# EAGLE design akabeacon_square_type2_da14580 (EAGLE 7.2.0)
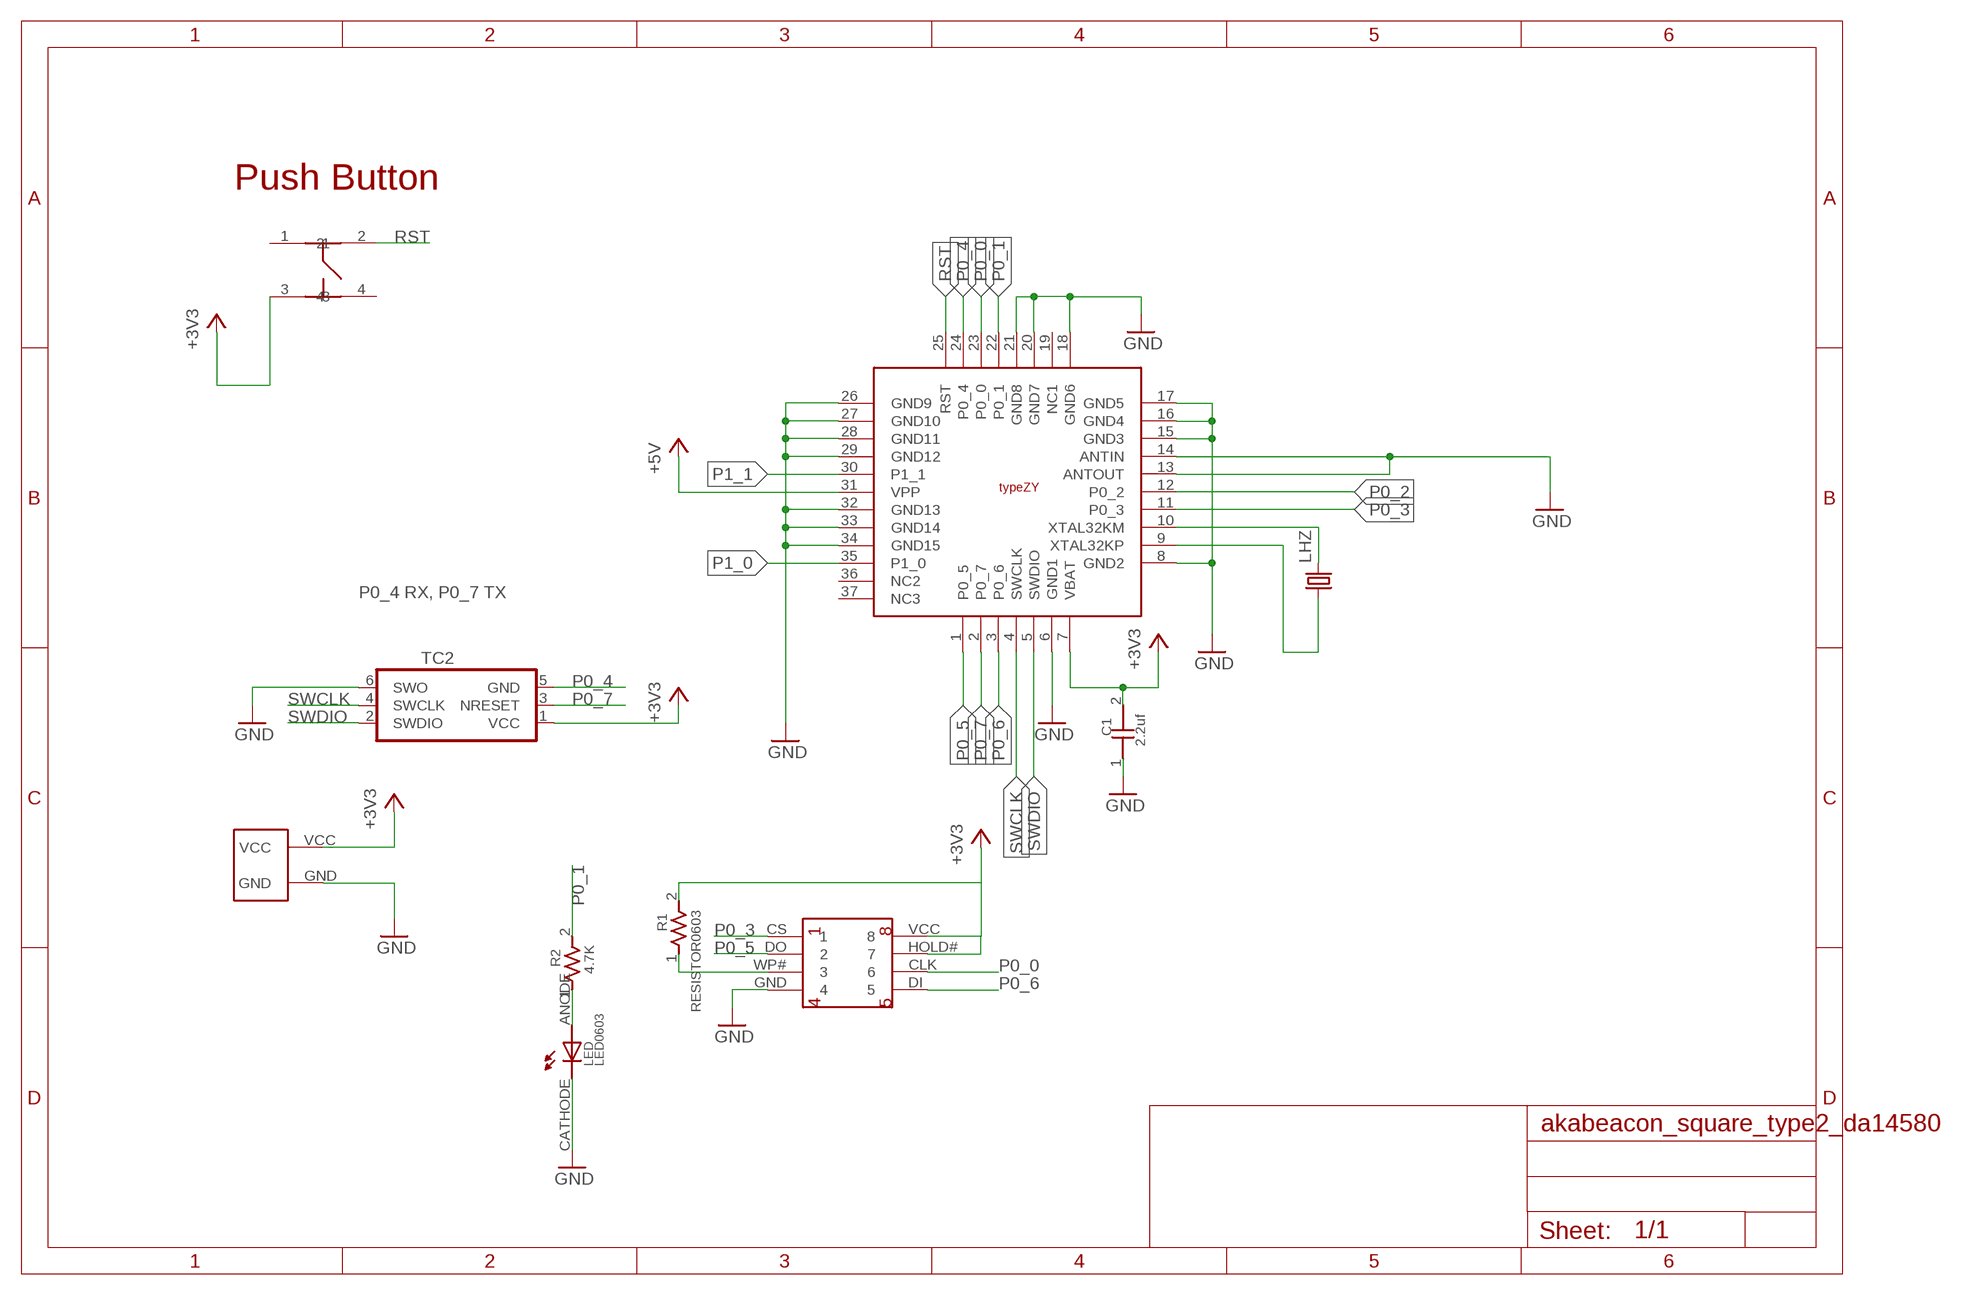
[diagram p0: schematic, sheet 1]

## Parts
C1  2.2uf  CAPACITOR0603  [0603]
LED  LED0603  [0603]
LHZ  FC-12M  [FC-12M]
R1  RESISTOR0603  [0603]
R2  4.7K  RESISTOR0603  [0603]
TC2  TC2030-IDC-NL  [TC2030-IDC-NL]
U$3  FLASH-MEMORY-2M(WINBOND)  [FLASH-MEMORY-2M(WINBOND)]
U$5  SQUARE-TYPE2-TC2030  [SQUARE-TYPE2-TC2030]
U$7  SWICTH-4P(KMR2)  [SWITCH-4P(KMR2)]
U$9  MURATA-TYPEZY  [MURATA_TYPEZY]

## Nets
+3V3: C1.2 R1.2 TC2.1(VCC) U$3.HOLD# U$3.VCC U$5.VCC U$7.3 U$9.7(VBAT)
+5V: U$9.31(VPP)
GND: C1.1 LED.CATHODE TC2.6(SWO) U$3.GND U$5.GND U$9.6(GND1) U$9.8(GND2) U$9.13(ANTOUT) U$9.14(ANTIN) U$9.15(GND3) U$9.16(GND4) U$9.17(GND5) U$9.18(GND6) U$9.20(GND7) U$9.21(GND8) U$9.26(GND9) U$9.27(GND10) U$9.28(GND11) U$9.29(GND12) U$9.32(GND13) U$9.33(GND14) U$9.34(GND15)
N$1: R1.1 U$3.WP#
N$2: LED.ANODE R2.1
P0_0: U$3.CLK U$9.23(P0_0)
P0_1: R2.2 U$9.22(P0_1)
P0_2: U$9.12(P0_2)
P0_3: U$3.CS U$9.11(P0_3)
P0_4: TC2.5(GND) U$9.24(P0_4)
P0_5: U$3.DO U$9.1(P0_5)
P0_6: U$3.DI U$9.3(P0_6)
P0_7: TC2.3(NRESET) U$9.2(P0_7)
P1_0: U$9.35(P1_0)
P1_1: U$9.30(P1_1)
RST: U$7.2 U$9.25(RST)
SWCLK: TC2.4(SWCLK) U$9.4(SWCLK)
SWDIO: TC2.2(SWDIO) U$9.5(SWDIO)
XTAL32KM: LHZ.2 U$9.10(XTAL32KM)
XTAL32KP: LHZ.1 U$9.9(XTAL32KP)
Unconnected: U$7.1 U$7.4 U$9.19(NC1) U$9.36(NC2) U$9.37(NC3)

## Notes on the sheet
- Push Button
- P0_4 RX, P0_7 TX

## Library data of the parts
C1 = GClue-Capacitor:CAPACITOR
LED = GClue-LED:LED
LHZ = crystal:FC-12M: kHz RANGE CRYSTAL UNIT LOW PROFILE SMD Source: Epson Toyocom FC-12M.pdf
R1 R2 = GClue-Resistors:RESISTOR
TC2 = TagConnect:TC2030-IDC: Tag-Connect In Circuit Programming & Debug Cable 6 Pin http://www.tag-connect.com
U$3 = gclue:FLASH-MEMORY-2M(WINBOND)
U$5 = GClue-Beacon:SQUARE-TYPE2-TC2030
U$7 = gclue-test:SWICTH-4P(KMR2)
U$9 = GClueBT:MURATA-TYPEZY

## Board
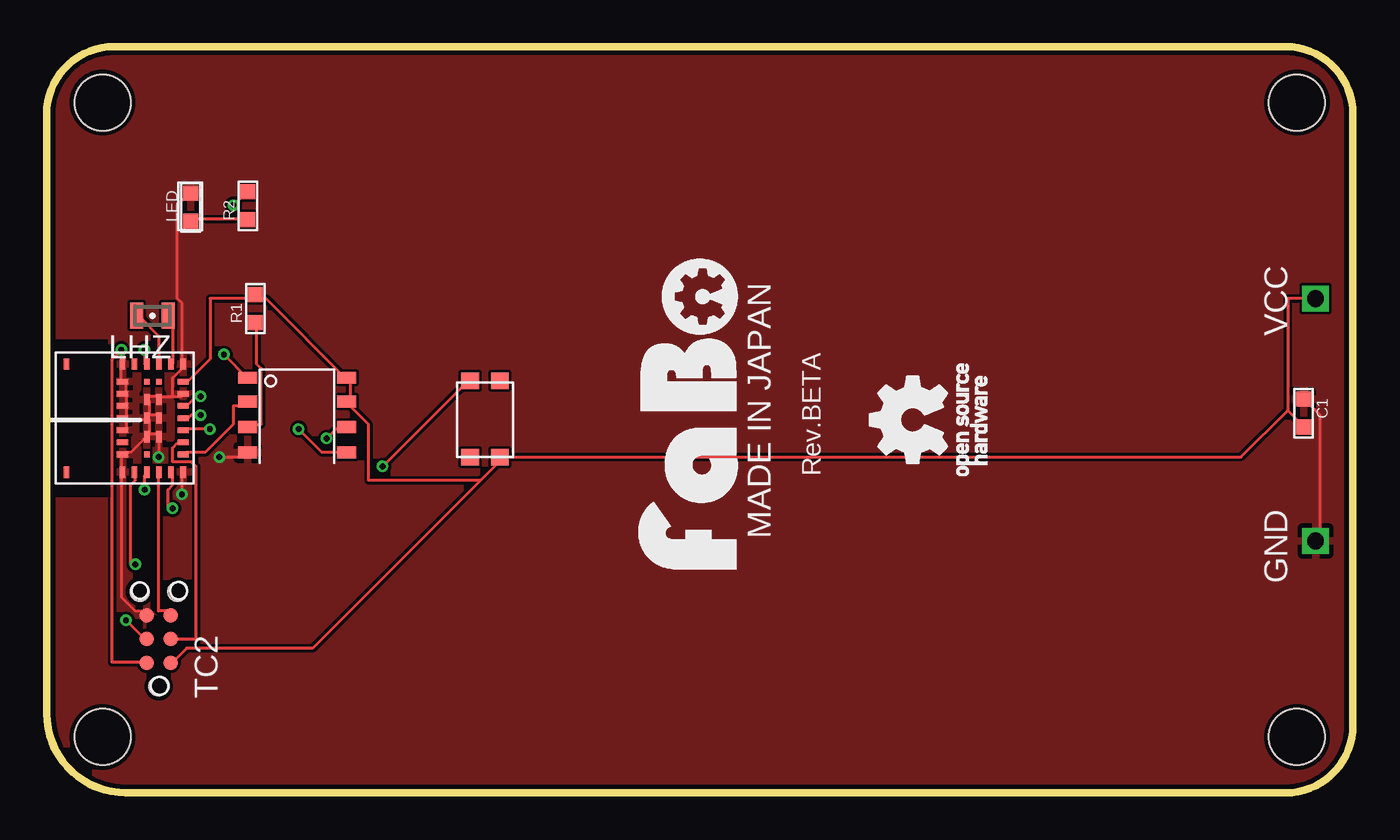
[diagram p1: board, top side]
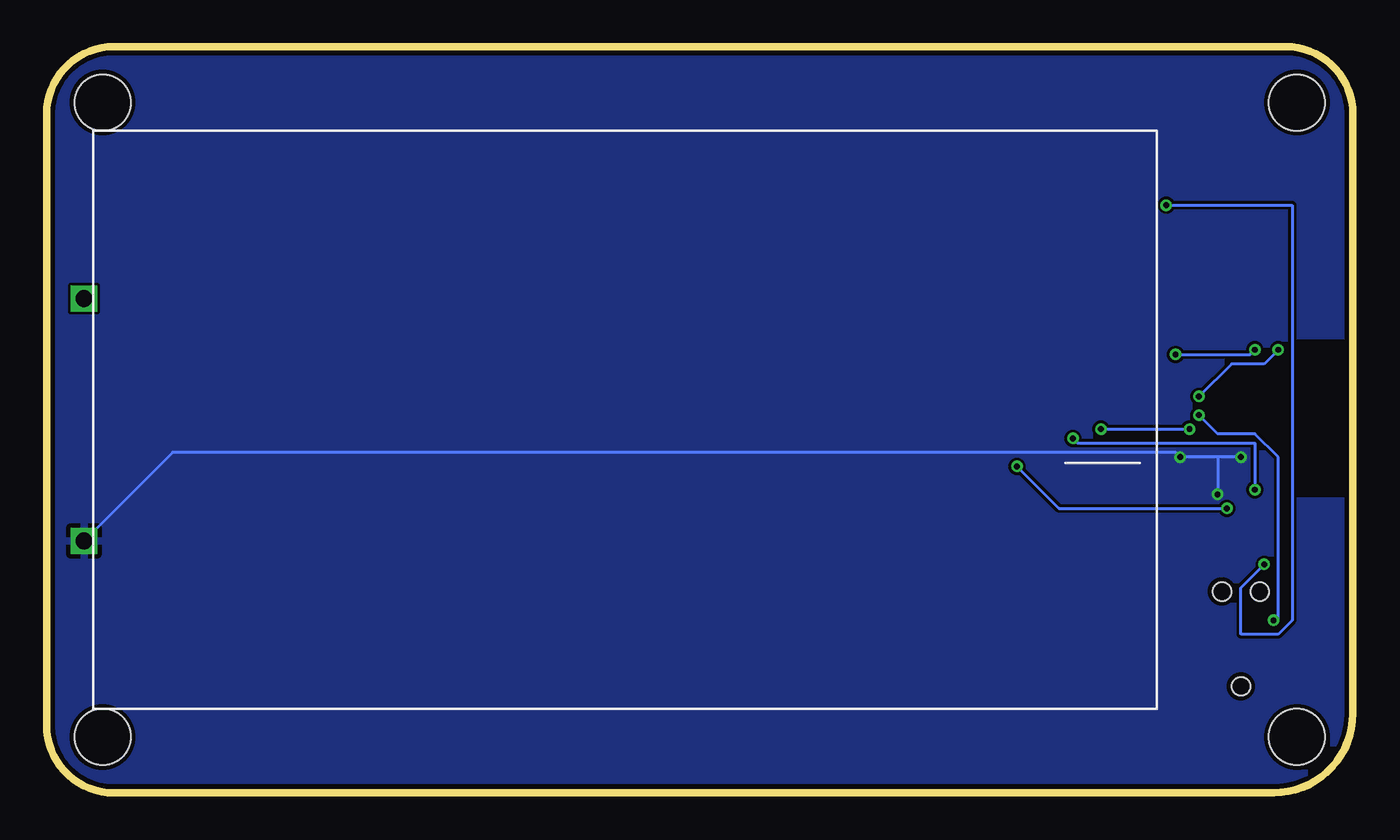
[diagram p2: board, bottom side, seen from below]

Size 70 x 40 mm. Coordinates in mm from the lower left corner, seen from the top.
Copper layers (1*16): Top 0.035mm / dielectric 1.5mm / Bottom 0.035mm
Design rules "SeeedStudio_2layer_DRU_no_angle_20140221": minimum track width 6mil, minimum drill 12mil, track to track 6mil, track to pad 6mil, pad to pad 6mil, via to via 6mil, smd to smd 0mil, copper to edge 10mil, drill to drill 10mil, minimum pad ring 10mil, minimum via ring 6mil, stop-mask expansion 2mil, vias tented up to drill 100mil, thermal gap 10mil
tRestrict: area -3,15.8 to 3.3,24.3
bRestrict: area -3,15.8 to 3.1,24.3

### Footprints (pad centres in the part's own frame; a part is rotated, then mirrored left to right if it is on the bottom)
0603 = smd 0.8 x 0.8: 1 -0.75,0; 2 0.75,0
0603' = smd 0.8 x 0.8: ANODE -0.75,0; CATHODE 0.75,0
FC-12M = smd 0.7 x 1.4: 1 -0.85,0; 2 0.85,0
TC2030-IDC-NL = smd 0.787 x 0.787: 1 -1.27,-0.635; 2 -1.27,0.635; 3 0,-0.635; 4 0,0.635; 5 1.27,-0.635; 6 1.27,0.635 | hole 0.991: -2.54,0; 2.54,1.016; 2.54,-1.016
FLASH-MEMORY-2M(WINBOND) = smd 1 x 0.635: CLK 2.67,0.2; CS -2.64,2.84; DI 2.67,-1.17; DO -2.64,1.57; GND -2.64,-1.17; HOLD# 2.67,1.57; VCC 2.67,2.84; WP# -2.64,0.2
SQUARE-TYPE2-TC2030 = drill 0.9 square: GND 33,-6.5; VCC 33,6.5 | hole 3: -32,17; -32,-17; 32,-17; 32,17
SWITCH-4P(KMR2) = smd 0.9 x 0.95: 1 -1,0; 2 3.1,0; 3 -1,-1.6; 4 3.1,-1.6
MURATA_TYPEZY = smd 0.3 x 0.6: 1 -1.95,-1.625; 2 -1.3,-1.625; 3 -0.65,-1.625; 4 0,-1.625; 5 0.65,-1.625; 6 1.3,-1.625; 7 1.95,-1.625; 14 1.95,1.625; 15 1.3,1.625; 16 0.65,1.625; 17 0,1.625; 18 -0.65,1.625; 19 -1.3,1.625; 20 -1.95,1.625 | smd 0.6 x 0.3: 8 2.9,-1.625; 9 2.9,-0.975; 10 2.9,-0.325; 11 2.9,0.325; 12 2.9,0.975; 13 2.9,1.625; 21 -2.9,1.625; 22 -2.9,0.975; 23 -2.9,0.325; 24 -2.9,-0.325; 25 -2.9,-0.975; 26 -2.9,-1.625; 27 -1,-0.325; 28 0,-0.325; 29 1,-0.325; 32 1,0.325; 33 0,0.325; 34 -1,0.325; 36 2.9,4.625; 37 -2.9,4.625 | smd 0.3 x 0.3: 30 1.95,-0.325; 31 1.95,0.325; 35 -1.95,0.325

### Placement (x,y rotation side)
C1  67.36,20.36 270 top
LED  LED0603  [0603']  7.72,31.39 90 top
LHZ  5.67,25.58 180 top
R1  11.18,25.96 90 top
R2  10.78,31.47 90 top
TC2  6,8.25 90 top
U$3  13.41,19.41 0 top
U$5  35,20 0 top
U$7  22.69,18.99 90 top
U$9  5.69,20.09 90 top

### Tracks (layer width: path | path; a pad name or v marks a point on that pad's centre or on a via)
+3V3
  Top 0.152: U$9.7 7.5,22 8.75,23.25 8.75,26.5 11,26.5 R1.2 11.25,26.5 11.75,26.5 16,22.25 U$3.VCC 16.25,22.25 16.25,21 U$3.HOLD# 16.25,20.75 17.25,19.75 17.25,16.75 23.25,16.75 | 66.5,20.5 67.25,19.75 C1.2 | 66.5,20.5 66.5,26.5 U$5.VCC | 23.25,16.75 24.25,17.75 U$7.3 24.5,18 64,18 66.5,20.5 | 23.25,16.75 14.25,7.75 7.5,7.75 6.75,7 TC2.1
GND  (via drill 0.3)
  Top 0.152: U$5.GND 68.25,13.5 68.25,20.25 67.5,21 C1.1 | TC2.6 5.25,9.75 4.75,9.75 4,10.5 4,17 U$9.21 4,17.25 4,18 U$9.20 4.25,18.25 4.5,18.25 5.25,19 U$9.34 5.5,19.25 | 5.5,19.25 6,19.25 U$9.27 6,19 v6,18 | v7.25,16 7.25,17 U$9.26 | v9.25,18 10.75,18 U$3.GND | 4.25,20 4.25,19.5 U$9.18 | 4.25,20.75 4.25,21.25 U$9.15 4.25,21.5 4.25,22 U$9.14 4,22 4,22.75 U$9.13 | 4.25,20.75 4.25,20 | 4.25,20.75 U$9.16 | 5.5,20.25 6,20.25 U$9.28 | 6,21.25 5.5,21.25 U$9.32 5.5,21 5.5,20.25 | 6,21.25 6.75,21.25 | 6.75,21.25 7.25,21.25 U$9.6 | 6,21.25 U$9.29 | 6.75,21.25 6.75,22.25 7.25,22.75 U$9.8 7.25,23 7.25,26.25 7,26.5 7,31.5 7.5,32 LED.CATHODE | 5.5,20.25 U$9.33 | 4.25,20 5.25,20 U$9.33 | 4.25,20 U$9.17 | 5.5,19.25 5.5,20 U$9.33
  Bottom 0.152: 7.25,18 v7.25,16 | v6,18 7.25,18 | 7.25,18 v9.25,18 9.5,18.25 63.25,18.25 U$5.GND
  pour Top: -0.5,0 70.5,0 70.5,40 -0.5,40
  pour Bottom: -0.5,0 70.5,0 70.5,40 -0.5,40
N$1
  Top 0.152: R1.1 11.25,25 11.25,23 11.5,22.75 11.5,19.75 11,19.75 U$3.WP#
N$2
  Top 0.152: LED.ANODE 7.75,30.75 10.75,30.75 R2.1
P0_0  (via drill 0.3)
  Top 0.152: v5.25,16.25 5.25,17 U$9.23 | v15,19 15.5,19.5 16,19.5 U$3.CLK
  Bottom 0.152: v5.25,16.25 5.25,18.75 14.75,18.75 v15,19
P0_1  (via drill 0.3)
  Top 0.152: v4.75,12.25 4.5,12.25 4.5,16.5 4.75,16.75 4.75,17 U$9.22 | v10,31.5 10.5,32 10.75,32 R2.2
  Bottom 0.152: v4.75,12.25 6,11 6,8.5 4,8.5 3.25,9.25 3.25,31.5 v10,31.5
P0_3  (via drill 0.3)
  Top 0.152: v5.25,23.75 5.25,23 U$9.11 | v9.5,23.5 10.75,22.25 U$3.CS
  Bottom 0.152: v5.25,23.75 5.5,23.5 v9.5,23.5
P0_4
  Top 0.152: U$9.24 6,17 6,9.75 6.5,9.75 TC2.5
P0_5
  Top 0.152: U$9.1 7.5,18.25 8.5,18.25 10,19.75 10,20.75 10.75,20.75 U$3.DO
P0_6  (via drill 0.3)
  Top 0.152: v8.75,19.5 7.5,19.5 U$9.3 | v13.5,19.5 14.75,18.25 16,18.25 U$3.DI
  Bottom 0.152: v13.5,19.5 v8.75,19.5
P0_7
  Top 0.152: TC2.3 8,8.25 8,17.5 7.75,17.75 6.75,17.75 6.75,18.5 7,18.75 7.25,18.75 U$9.2
RST  (via drill 0.3)
  Top 0.152: v6.75,15.25 6.5,15.25 6.5,16.25 6.75,16.5 6.75,17 U$9.25 | v18,17.5 22.5,22 U$7.2
  Bottom 0.152: v6.75,15.25 15.75,15.25 v18,17.5
SWCLK  (via drill 0.3)
  Top 0.152: v8.25,20.25 7.75,20.25 7.5,20 U$9.4 | v4.25,9.25 5.25,8.25 TC2.4
  Bottom 0.152: v8.25,20.25 7.25,19.25 5.25,19.25 4,18 4,9.25 v4.25,9.25
SWDIO  (via drill 0.3)
  Top 0.152: v8.25,21.25 8,21.25 7.5,20.75 U$9.5 | v4,23.75 3.5,23.25 3.5,7 5.25,7 TC2.2
  Bottom 0.152: v8.25,21.25 6.5,23 4.75,23 v4,23.75
XTAL32KM
  Top 0.152: U$9.10 6,23 6,24.5 5,25.5 LHZ.2
XTAL32KP
  Top 0.152: U$9.9 6.75,23 6.75,25.5 LHZ.1

### Text on the board
tPlace: Rev.BETA